# Altium project MotorDriver_Version1.0.PrjPcb
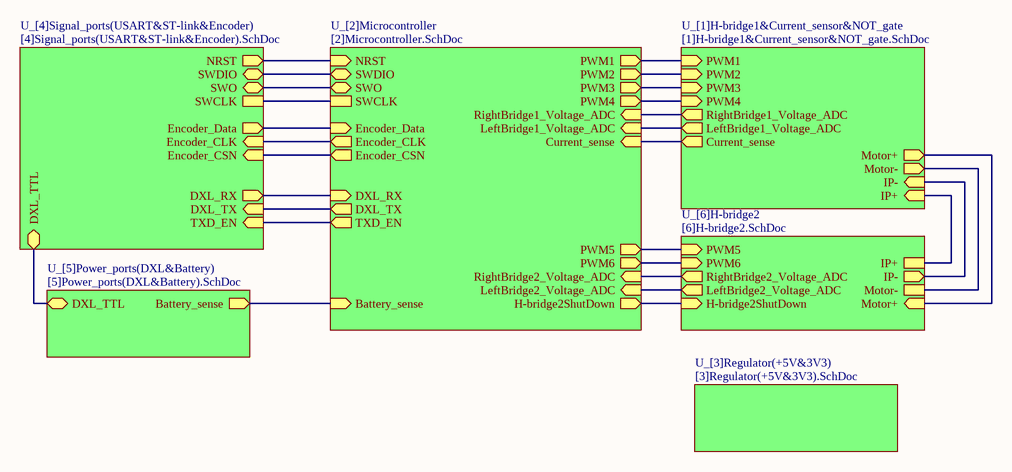
[diagram p0: [0]MotorDriver.SchDoc]
7 sheets, 112 parts. Net scope: hierarchical (ports join the sheet entries above them; power ports are global).
Board file: MotorDriver_Version1.0.PcbDoc
Sheets:
  [0]MotorDriver.SchDoc
    U_[1]H-bridge1&Current_sensor&NOT_gate = [1]H-bridge1&Current_sensor&NOT_gate.SchDoc
    U_[2]Microcontroller = [2]Microcontroller.SchDoc
    U_[3]Regulator(+5V&3V3) = [3]Regulator(+5V&3V3).SchDoc
    U_[5]Power_ports(DXL&Battery) = [5]Power_ports(DXL&Battery).SchDoc
    U_[6]H-bridge2 = [6]H-bridge2.SchDoc
    U_[4]Signal_ports(USART&ST-link&Encoder) = [4]Signal_ports(USART&ST-link&Encoder).SchDoc

## Sheet [0]MotorDriver.SchDoc
size A

### Sub-sheets
U_[1]H-bridge1&Current_sensor&NOT_gate = [1]H-bridge1&Current_sensor&NOT_gate.SchDoc: PWM1 (in), PWM2 (in), PWM3 (in), PWM4 (in), Current_sense (out), RightBridge1_Voltage_ADC (out), LeftBridge1_Voltage_ADC (out), Motor+ (out), Motor- (out), IP+ (in), IP- (in)
U_[2]Microcontroller = [2]Microcontroller.SchDoc: SWDIO (bidir), SWCLK, PWM1 (out), PWM2 (out), PWM3 (out), PWM4 (out), NRST (in), SWO (bidir), DXL_TX (out), DXL_RX (in), Current_sense (in), LeftBridge1_Voltage_ADC (in), RightBridge1_Voltage_ADC (in), Battery_sense (in), Encoder_CLK (out), Encoder_Data (in), Encoder_CSN (out), H-bridge2ShutDown (out), RightBridge2_Voltage_ADC (in), LeftBridge2_Voltage_ADC (in), PWM5 (out), PWM6 (out), TXD_EN (out)
U_[3]Regulator(+5V&3V3) = [3]Regulator(+5V&3V3).SchDoc: no entries
U_[4]Signal_ports(USART&ST-link&Encoder) = [4]Signal_ports(USART&ST-link&Encoder).SchDoc: SWDIO (bidir), SWCLK, SWO (bidir), NRST (out), Encoder_CLK (in), Encoder_CSN (in), Encoder_Data (out), TXD_EN (in), DXL_TX (in), DXL_RX (out), DXL_TTL (bidir)
U_[5]Power_ports(DXL&Battery) = [5]Power_ports(DXL&Battery).SchDoc: Battery_sense (out), DXL_TTL (bidir)
U_[6]H-bridge2 = [6]H-bridge2.SchDoc: H-bridge2ShutDown (in), PWM6 (in), PWM5 (in), IP+, IP- (out), LeftBridge2_Voltage_ADC (out), RightBridge2_Voltage_ADC (out), Motor-, Motor+ (in)

### Nets
H-bridge2ShutDown: sheet U_[2]Microcontroller/H-bridge2ShutDown, sheet U_[6]H-bridge2/H-bridge2ShutDown
IP+: sheet U_[1]H-bridge1&Current_sensor&NOT_gate/IP+, sheet U_[6]H-bridge2/IP+
IP-: sheet U_[1]H-bridge1&Current_sensor&NOT_gate/Motor+, sheet U_[1]H-bridge1&Current_sensor&NOT_gate/IP-, sheet U_[6]H-bridge2/IP-, sheet U_[6]H-bridge2/Motor+
NRST: sheet U_[2]Microcontroller/NRST, sheet U_[4]Signal_ports(USART&ST-link&Encoder)/NRST
PWM1: sheet U_[1]H-bridge1&Current_sensor&NOT_gate/PWM1, sheet U_[2]Microcontroller/PWM1
PWM2: sheet U_[1]H-bridge1&Current_sensor&NOT_gate/PWM2, sheet U_[2]Microcontroller/PWM2
SWO: sheet U_[2]Microcontroller/SWO, sheet U_[4]Signal_ports(USART&ST-link&Encoder)/SWO
NetB3_2: sheet U_[2]Microcontroller/PWM6, sheet U_[6]H-bridge2/PWM6
NetB3_6: sheet U_[1]H-bridge1&Current_sensor&NOT_gate/Motor-, sheet U_[6]H-bridge2/Motor-
NetB5_2: sheet U_[2]Microcontroller/PWM5, sheet U_[6]H-bridge2/PWM5
NetDXL_Encoder_A2: sheet U_[2]Microcontroller/Encoder_CSN, sheet U_[4]Signal_ports(USART&ST-link&Encoder)/Encoder_CSN
NetDXL_Encoder_A4: sheet U_[2]Microcontroller/Encoder_Data, sheet U_[4]Signal_ports(USART&ST-link&Encoder)/Encoder_Data
NetDXL_Encoder_A6: sheet U_[2]Microcontroller/Encoder_CLK, sheet U_[4]Signal_ports(USART&ST-link&Encoder)/Encoder_CLK
NetMotor_DXL_3: sheet U_[5]Power_ports(DXL&Battery)/DXL_TTL, sheet U_[4]Signal_ports(USART&ST-link&Encoder)/DXL_TTL
NetR6_1: sheet U_[1]H-bridge1&Current_sensor&NOT_gate/PWM3, sheet U_[2]Microcontroller/PWM3
NetR8_2: sheet U_[1]H-bridge1&Current_sensor&NOT_gate/PWM4, sheet U_[2]Microcontroller/PWM4
NetR13_1: sheet U_[2]Microcontroller/Battery_sense, sheet U_[5]Power_ports(DXL&Battery)/Battery_sense
NetR15_1: sheet U_[1]H-bridge1&Current_sensor&NOT_gate/LeftBridge1_Voltage_ADC, sheet U_[2]Microcontroller/LeftBridge1_Voltage_ADC
NetR17_1: sheet U_[1]H-bridge1&Current_sensor&NOT_gate/RightBridge1_Voltage_ADC, sheet U_[2]Microcontroller/RightBridge1_Voltage_ADC
NetR33_1: sheet U_[2]Microcontroller/LeftBridge2_Voltage_ADC, sheet U_[6]H-bridge2/LeftBridge2_Voltage_ADC
NetR35_1: sheet U_[2]Microcontroller/RightBridge2_Voltage_ADC, sheet U_[6]H-bridge2/RightBridge2_Voltage_ADC
NetR39_1: sheet U_[2]Microcontroller/DXL_RX, sheet U_[4]Signal_ports(USART&ST-link&Encoder)/DXL_RX
NetR44_2: sheet U_[1]H-bridge1&Current_sensor&NOT_gate/Current_sense, sheet U_[2]Microcontroller/Current_sense
NetST-link_2: sheet U_[2]Microcontroller/SWDIO, sheet U_[4]Signal_ports(USART&ST-link&Encoder)/SWDIO
NetST-link_3: sheet U_[2]Microcontroller/SWCLK, sheet U_[4]Signal_ports(USART&ST-link&Encoder)/SWCLK
NetU1_20: sheet U_[2]Microcontroller/TXD_EN, sheet U_[4]Signal_ports(USART&ST-link&Encoder)/TXD_EN
NetU1_21: sheet U_[2]Microcontroller/DXL_TX, sheet U_[4]Signal_ports(USART&ST-link&Encoder)/DXL_TX

## Sheet [1]H-bridge1&Current_sensor&NOT_gate.SchDoc
size A3
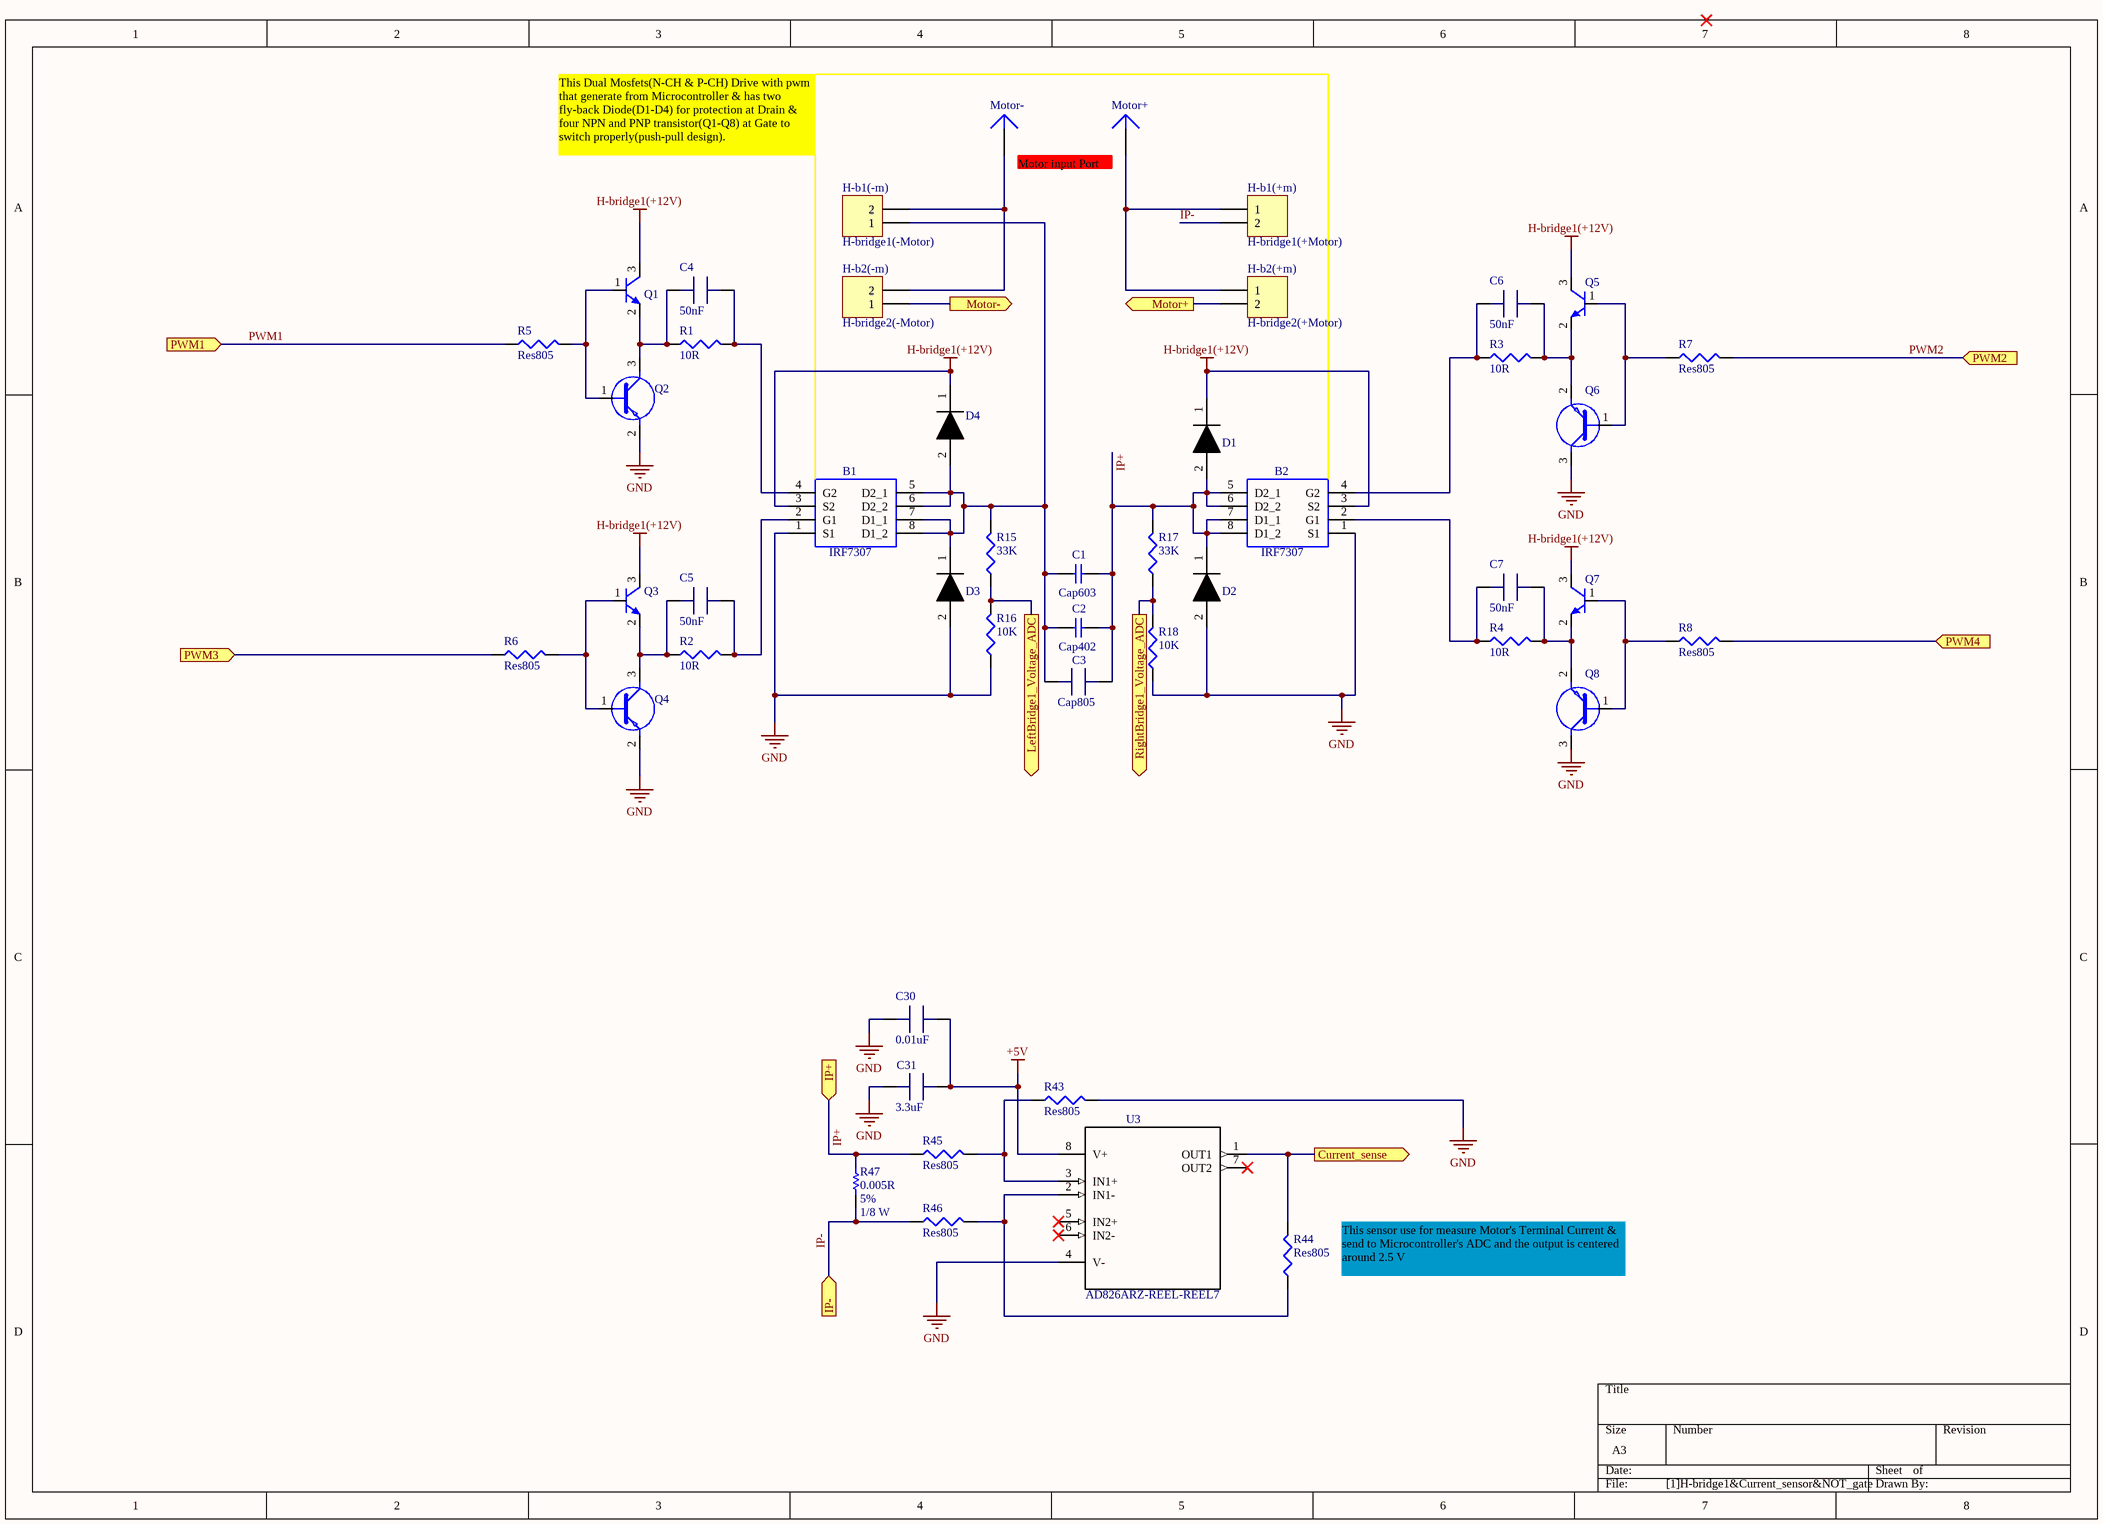
[diagram p1: [1]H-bridge1&Current_sensor&NOT_gate.SchDoc]

### Parts
B1  IRF7307  [SOIC127P600X175-8N]
B2  IRF7307  [SOIC127P600X175-8N]
C1  Cap603  [Cap603]
C2  Cap402  [Cap402]
C3  Cap805  [cap_805]
C4  50nF  [cap_805]
C5  50nF  [cap_805]
C6  50nF  [cap_805]
C7  50nF  [cap_805]
C30  0.01uF  [cap_805]
C31  3.3uF  [cap_805]
D1  Doide_SS34  [Doide_SS34]  (value not drawn)
D2  Doide_SS34  [Doide_SS34]  (value not drawn)
D3  Doide_SS34  [Doide_SS34]  (value not drawn)
D4  Doide_SS34  [Doide_SS34]  (value not drawn)
H-b1(+m)  H-bridge1(+Motor)  [HDR1X2]
H-b1(-m)  H-bridge1(-Motor)  [HDR1X2]
H-b2(+m)  H-bridge2(+Motor)  [HDR1X2]
H-b2(-m)  H-bridge2(-Motor)  [HDR1X2]
Motor+  Plug  [PIN1]  (value not drawn)
Motor-  Plug  [PIN1]  (value not drawn)
Q1  NPN(mmbt2222)  [MMBT2222]  (value not drawn)
Q2  MMBT2907A-7-F  [SOT96P240X100-3N]  (value not drawn)
Q3  NPN(mmbt2222)  [MMBT2222]  (value not drawn)
Q4  MMBT2907A-7-F  [SOT96P240X100-3N]  (value not drawn)
Q5  NPN(MMBT2222)  [MMBT2222]  (value not drawn)
Q6  MMBT2907A-7-F  [SOT96P240X100-3N]  (value not drawn)
Q7  NPN(mmbt2222)  [MMBT2222]  (value not drawn)
Q8  MMBT2907A-7-F  [SOT96P240X100-3N]  (value not drawn)
R1  10R  [Res805]
R2  10R  [Res805]
R3  10R  [Res805]
R4  10R  [Res805]
R5  Res805  [Res805]
R6  Res805  [Res805]
R7  Res805  [Res805]
R8  Res805  [Res805]
R15  33K  [Res805]
R16  10K  [Res805]
R17  33K  [Res805]
R18  10K  [Res805]
R43  Res805  [Res805]
R44  Res805  [Res805]
R45  Res805  [Res805]
R46  Res805  [Res805]
R47  Tolerance: 5%  Power: 1/8 W  [RES 2512 (6331X07L)]  (hidden comment: 0.005R)
U3  AD826ARZ-REEL-REEL7  [*SOIC127P600X175-8N]

### Ports
Current_sense (out), IP+ (in), IP- (in), LeftBridge1_Voltage_ADC (out), Motor+ (out), Motor- (out), PWM1 (in), PWM2 (in), PWM3 (in), PWM4 (in), RightBridge1_Voltage_ADC (out)

### Nets
+5V: C30.2 C31.2 U3.8(V+)
GND: B1.1(S1) B2.1(S1) C30.1 C31.1 D2.2 D3.2 Q2.2(E) Q4.2(E) Q6.3(C) Q8.3(C) R16.1 R18.1 R43.2 U3.4(V-)
H-bridge1(+12V): B1.3(S2) B2.3(S2) D1.1 D4.1 Q1.3(C) Q3.3(C) Q5.3(C) Q7.3(C)
IP+: B2.5(D2_1) B2.6(D2_2) B2.7(D1_1) B2.8(D1_2) C1.2 C2.2 C3.2 D1.2 D2.1 R17.2 R45.1 R47.2 ; port IP+
IP-: H-b1(+m).2 H-b2(+m).2 R46.1 R47.1 ; port Motor+, port IP-
PWM1: R5.1 ; port PWM1
PWM2: R7.2 ; port PWM2
NetB1_2: B1.2(G1) C5.2 R2.2
NetB1_4: B1.4(G2) C4.2 R1.2
NetB1_5: B1.5(D2_1) B1.6(D2_2) B1.7(D1_1) B1.8(D1_2) C1.1 C2.1 C3.1 D3.1 D4.2 H-b1(-m).1 R15.2
NetB2_2: B2.2(G1) C7.1 R4.1
NetB2_4: B2.4(G2) C6.1 R3.1
NetB3_6: H-b2(-m).1 ; port Motor-
NetC4_1: C4.1 Q1.2(E) Q2.3(C) R1.1
NetC5_1: C5.1 Q3.2(E) Q4.3(C) R2.1
NetC6_2: C6.2 Q5.2(E) Q6.2(E) R3.2
NetC7_2: C7.2 Q7.2(E) Q8.2(E) R4.2
NetH-b1(+m)_1: H-b1(+m).1 H-b2(+m).1 Motor+.1
NetH-b1(-m)_2: H-b1(-m).2 H-b2(-m).2 Motor-.1
NetQ1_1: Q1.1(B) Q2.1(B) R5.2
NetQ3_1: Q3.1(B) Q4.1(B) R6.2
NetQ5_1: Q5.1(B) Q6.1(B) R7.1
NetQ7_1: Q7.1(B) Q8.1(B) R8.1
NetR6_1: R6.1 ; port PWM3
NetR8_2: R8.2 ; port PWM4
NetR15_1: R15.1 R16.2 ; port LeftBridge1_Voltage_ADC
NetR17_1: R17.1 R18.2 ; port RightBridge1_Voltage_ADC
NetR43_1: R43.1 R45.2 U3.3(IN1+)
NetR44_1: R44.1 R46.2 U3.2(IN1-)
NetR44_2: R44.2 U3.1(OUT1) ; port Current_sense

Not connected (* = marked no-connect by the designer): U3 5(IN2+)* 6(IN2-)* 7(OUT2)*

### Notes on the sheet
- This Dual Mosfets(N-CH & P-CH) Drive with pwm that generate from Microcontroller & has two fly-back Diode(D1-D4) for protection at Drain & four NPN and PNP transistor(Q1-Q8) at Gate to switch properly(push-pull design).
- Motor input Port
- This sensor use for measure Motor's Terminal Current & send to Microcontroller's ADC and the output is centered around 2.5 V

### Library data of the parts
B1 B2 = IRF7307: Power MOSFET; Manufacturer_Name: International Rectifier; Geometry.Height: 1.75mm; Manufacturer_Part_Number: IRF7307; RS Part Number: 2171031; RS Price/Stock: http://uk.rs-online.com/web/p/products/2171031; Arrow Part Number: IRF7307; Arrow Price/Stock: http://uk.rs-online.com/web/p/products/2171031; Datasheet Link: www.farnell.com/datasheets/137583.pdf
C4-C7 C30 C31 = cap805
H-b1(+m) H-b1(-m) H-b2(+m) H-b2(-m) = Header 2: Header, 2-Pin; LatestRevisionDate: 17-Jul-2002; LatestRevisionNote: Re-released for DXP Platform.; Publisher: Altium Limited
Q1 Q3 Q5 Q7 = MMBT2222
Q2 Q4 Q6 Q8 = MMBT2907A-7-F: Diodes Inc MMBT2907A-7-F PNP Bipolar Transistor, -600 mA, -60 V, 3-Pin SOT-23; Manufacturer_Name: Diodes Inc.; Geometry.Height: 1mm; Manufacturer_Part_Number: MMBT2907A-7-F; RS Part Number: 7114875P; RS Price/Stock: http://uk.rs-online.com/web/p/products/7114875P; Arrow Part Number: MMBT2907A-7-F; Arrow Price/Stock: https://www.arrow.com/en/products/mmbt2907a-7-f/diodes-incorporated; Datasheet Link: https://www.diodes.com/assets/Datasheets/ds30040.pdf
R1-R4 R15-R18 = Res805
R47 = RES: Resistor; Designer: Saeid Jorablo; Category: Resistors; PackageDescription: SMD & TH Resistors; Publisher: Altium Limited; Mounting Technology: Surface Mount\Through-Hole; Value: 0.005R; HelpURL: http://s3.picofile.com/file/7443264187/Coming_Soon_logo.gif
U3 = AD826ARZ-REEL-REEL7: OP Amp Dual Volt Fdbk Ã‚Â±18V/36V 8-Pin SO T/R; MP: AD826ARZ-REEL7; MF: Analog Devices; Package: SOIC-8 Analog Devices; Price: None; SnapEDA_Link: https://www.snapeda.com/parts/AD826ARZ-REEL7/Analog%20Devices%20Inc./view-part/?ref=snap; Availability: Unavailable; Value: *
Motor+ Motor- = Plug: LatestRevisionDate: 17-Jul-2002; LatestRevisionNote: Re-released for DXP Platform.; Publisher: Altium Limited

## Sheet [2]Microcontroller.SchDoc
size A
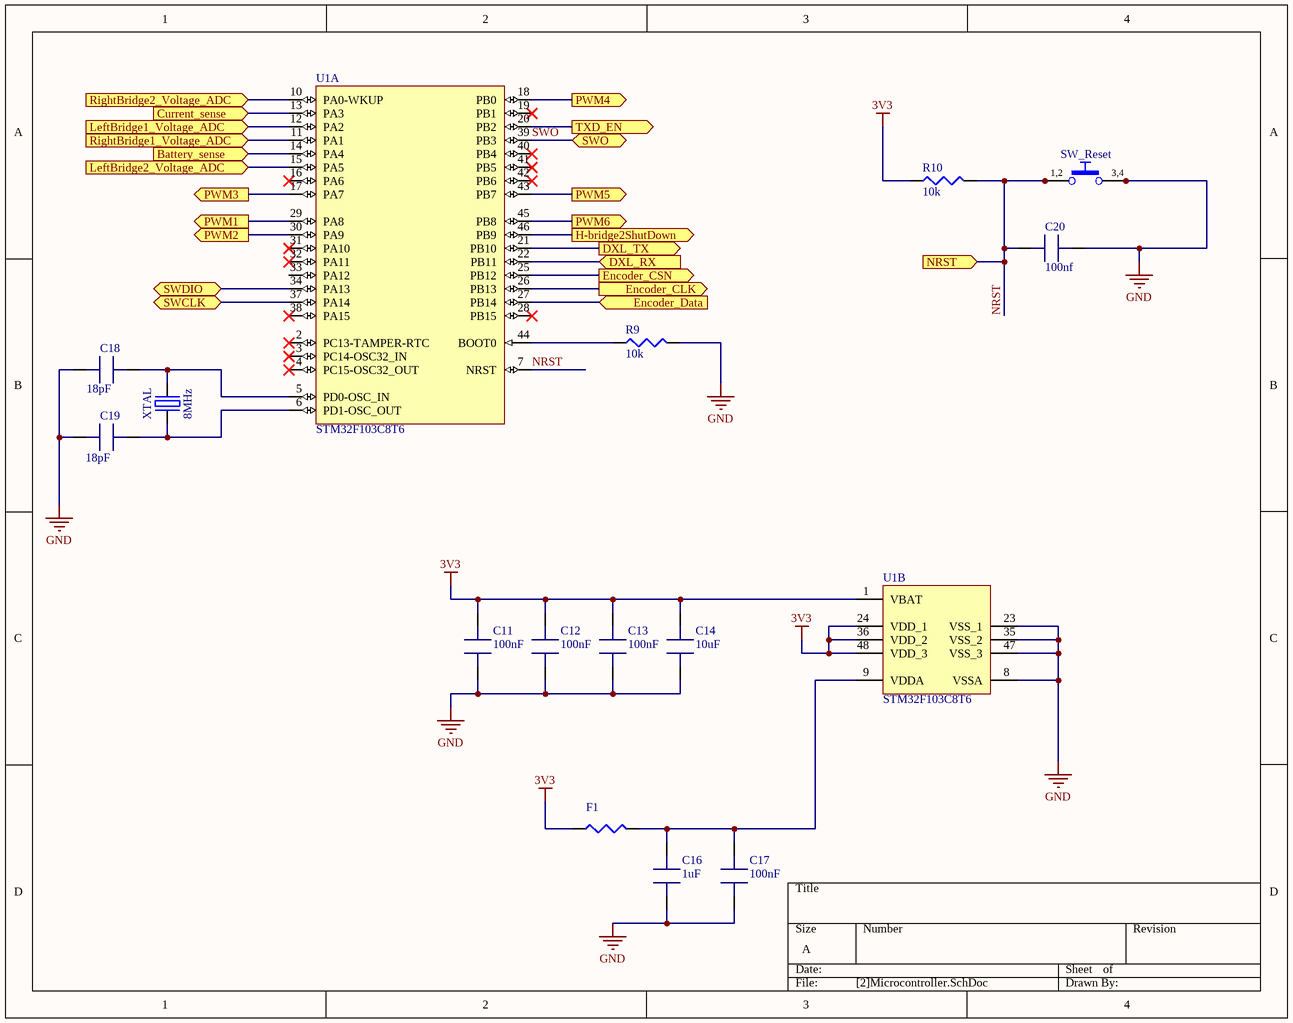
[diagram p2: [2]Microcontroller.SchDoc]

### Parts
C11  100nF  [cap_805]
C12  100nF  [cap_805]
C13  100nF  [cap_805]
C14  10uF  [cap_805]
C16  1uF  [cap_805]
C17  100nF  [cap_805]
C18  18pF  [cap_805]
C19  18pF  [cap_805]
C20  100nf  [cap_805]
F1  Res805  [Res805]  (value not drawn)
R9  10k  [Res805]
R10  10k  [Res805]
SW_Reset  Push Button  [PB_OMRON_B3F-1000]  (value not drawn)
U1  STM32F103C8T6  [STM-LQFP48_N]  (parts A,B of 2)
XTAL  8MHz  [XTAL_HC-49/U]

### Ports
Battery_sense (in), Current_sense (in), DXL_RX (in), DXL_TX (out), Encoder_CLK (out), Encoder_CSN (out), Encoder_Data (in), H-bridge2ShutDown (out), LeftBridge1_Voltage_ADC (in), LeftBridge2_Voltage_ADC (in), NRST (in), PWM1 (out), PWM2 (out), PWM3 (out), PWM4 (out), PWM5 (out), PWM6 (out), RightBridge1_Voltage_ADC (in), RightBridge2_Voltage_ADC (in), SWCLK, SWDIO (bidir), SWO (bidir), TXD_EN (out)

### Nets
3V3: C11.2 C12.2 C13.2 C14.2 F1.1 R10.1 U1.1(VBAT) U1.24(VDD_1) U1.36(VDD_2) U1.48(VDD_3)
GND: C11.1 C12.1 C13.1 C14.1 C16.1 C17.1 C18.1 C19.1 C20.2 R9.2 SW_Reset.3 SW_Reset.4 U1.8(VSSA) U1.23(VSS_1) U1.35(VSS_2) U1.47(VSS_3)
H-bridge2ShutDown: U1.46(PB9) ; port H-bridge2ShutDown
NRST: C20.1 R10.2 SW_Reset.1 SW_Reset.2 U1.7(NRST) ; port NRST
PWM1: U1.29(PA8) ; port PWM1
PWM2: U1.30(PA9) ; port PWM2
SWO: U1.39(PB3) ; port SWO
NetB3_2: U1.45(PB8) ; port PWM6
NetB5_2: U1.43(PB7) ; port PWM5
NetC16_2: C16.2 C17.2 F1.2 U1.9(VDDA)
NetC18_2: C18.2 U1.5(PD0-OSC_IN) XTAL.2(OSC2)
NetC19_2: C19.2 U1.6(PD1-OSC_OUT) XTAL.1(OSC1)
NetDXL_Encoder_A2: U1.25(PB12) ; port Encoder_CSN
NetDXL_Encoder_A4: U1.27(PB14) ; port Encoder_Data
NetDXL_Encoder_A6: U1.26(PB13) ; port Encoder_CLK
NetR6_1: U1.17(PA7) ; port PWM3
NetR8_2: U1.18(PB0) ; port PWM4
NetR9_1: R9.1 U1.44(BOOT0)
NetR13_1: U1.14(PA4) ; port Battery_sense
NetR15_1: U1.12(PA2) ; port LeftBridge1_Voltage_ADC
NetR17_1: U1.11(PA1) ; port RightBridge1_Voltage_ADC
NetR33_1: U1.15(PA5) ; port LeftBridge2_Voltage_ADC
NetR35_1: U1.10(PA0-WKUP) ; port RightBridge2_Voltage_ADC
NetR39_1: U1.22(PB11) ; port DXL_RX
NetR44_2: U1.13(PA3) ; port Current_sense
NetST-link_2: U1.34(PA13) ; port SWDIO
NetST-link_3: U1.37(PA14) ; port SWCLK
NetU1_20: U1.20(PB2) ; port TXD_EN
NetU1_21: U1.21(PB10) ; port DXL_TX

Not connected (* = marked no-connect by the designer): U1 2(PC13-TAMPER-RTC)* 3(PC14-OSC32_IN)* 4(PC15-OSC32_OUT)* 16(PA6)* 19(PB1)* 28(PB15)* 31(PA10)* 32(PA11)* 33(PA12) 38(PA15)* 40(PB4)* 41(PB5)* 42(PB6)*

### Notes on the sheet
- (in symbol PB_OMRON_B3F-1000) 1,2; 3,4

### Library data of the parts
C11-C14 C16-C20 = cap805
R9 R10 = Res805
SW_Reset = PB_OMRON_B3F-1000: Push-Button Switch SPDT; Part Description: 24VDC 50mA SPST-NO Tactile Push-Button Switch (h=4.5mm); Manufacturer: OMRON; Table: Switches; Part Number: PB_OMRON_B3F-1000; Component Kind: Standard; Component Type: Standard; Pin Count: 4; PackageDescription: 6x6mm Model, Horizontal, Flat Plunger Type (without Ground Terminal) Pushbutton Switch, OMRON B3F Series; Family: Push Button; Mounted: Yes; Socket: No; SMD: No; Status: None; Manufacturer Part Number: B3F-1000; ComponentHeight: 4.5mm; HelpURL: \\cern.ch\dfs\Applications\Altium\Datasheets\PB_OMRON_B3F-1000.pdf; Author: CERN DEM JMW; CreateDate: 10/23/2008; LatestRevisionDate: 5/6/2009
U1 = STM32F103C8T6: ARM Cortex-M3 32-bit MCU, 64 KB Flash, 20 KB Internal RAM, 37 I/Os, 48-pin LQFP, -40 to 85 degC, Tray; A/D Converter: 2x12-bit (10 Channel); FLASH Size (Prog) (kB): 64; I/Os (High Current): 37; Internal RAM Size (kB): 20; Operating Frequency(F) (Processor speed) (MHz): 72; Supply Voltage(Vcc) min (V): 2; DatasheetVersion: Rev. 16; PackageVersion: Rev. 6, 06/2013; PackageReference: LQFP48; PackageDescription: 48-Pin Low Profile Quad Flat Package, 7 x 7 mm Body, 0.5 mm Pitch; Supplier 1: Digi-Key; Supplier Part Number 1: 497-6063-ND; Supplier 2: Farnell; Supplier Part Number 2: 1447637; Supplier 3: Newark; Supplier Part Number 3: 59M2182; Supplier 4: Newark; Supplier Part Number 4: 57P1222; Supplier 5: Mouser; Supplier Part Number 5: 511-STM32F103C8T6; Core: ARM Cortex-M3; Packing: Tray; Mounting Technology: Surface Mount; PartNumber: STM32F103C8T6; ComponentLink1Description: Manufacturer URL; ComponentLink1URL: http://www.st.com/web/en/home.html; ComponentLink2Description: Datasheet; ComponentLink2URL: http://www.st.com/st-web-ui/static/active/en/resource/technical/document/datasheet/CD00161566.pdf; ComponentLink3Description: Package Specification; ComponentLink3URL: http://www.st.com/st-web-ui/static/active/en/resource/technical/document/datasheet/DM00058181.pdf
XTAL = XTAL_20MHZ_AEL_HC-49/U: Quartz Crystal; Part Description: ±30ppm Quartz Crystal Resonator, HC-49/U Type; Manufacturer: AEL CRYSTALS; Manufacturer Part Number: X20M000000L010; Value: 20MHz; Table: Crystals & Oscillators; Part Number: XTAL_20MHZ_AEL_HC-49/U; Component Kind: Standard; Component Type: Standard; PackageDescription: HC-49/U Leaded Cristal, Body 11.05x4.8mm; Pitch 4.88mm; Pin Count: 2; Mounted: Yes; Socket: No; SMD: No; ComponentHeight: 13.6mm; HelpURL: \\cern.ch\dfs\Applications\Altium\Datasheets\XTAL_AEL_HC-49-U.pdf; Author: CERN DEM JMW; CreateDate: 10/31/2008; LatestRevisionDate: 5/13/2011

## Sheet [3]Regulator(+5V&3V3).SchDoc
size A; PageSetup: Record=PageOptions|CenterHorizontal=True|CenterVertical=True|PrintScale=1.00|XCorrection=1.00|YCorrection=1.00|PrintKind=1|BorderSize=5000000|LeftOffset=0|BottomOffset=0|Orientation=1|PaperLength=1000|PaperWidth=1000|Scale=100|PaperSource=7|PrintQuality=-3|MediaType=1|DitherType=10|PrintScaleMode=1|PaperKind=Letter|PaperIndex=1
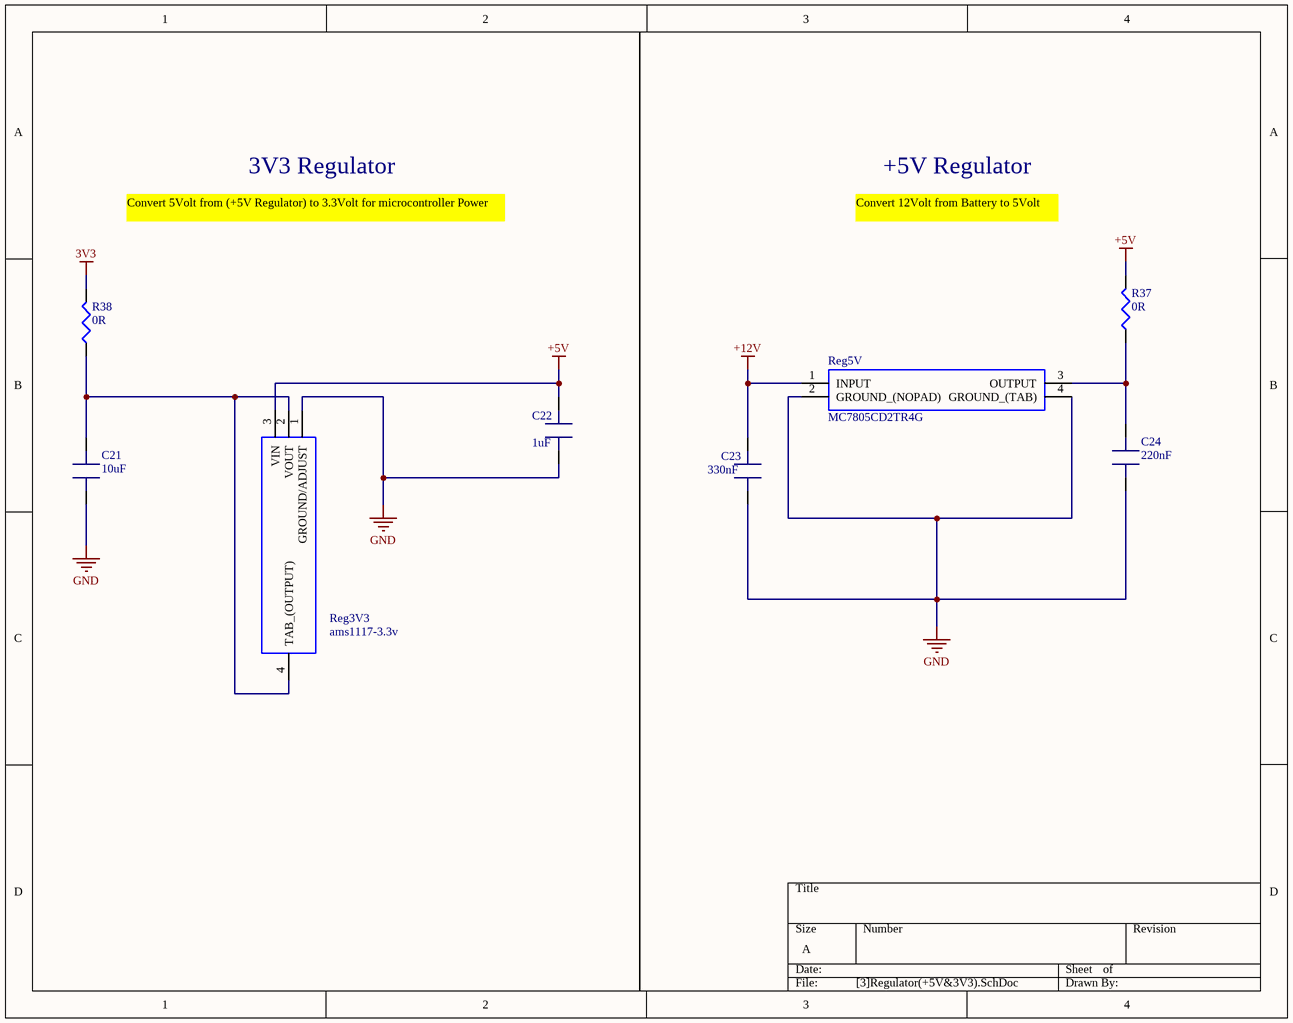
[diagram p3: [3]Regulator(+5V&3V3).SchDoc]

### Parts
C21  10uF  [cap_805]
C22  1uF  [cap_805]
C23  330nF  [cap_805]
C24  220nF  [cap_805]
R37  0R  [Res805]
R38  0R  [Res805]
Reg3V3  ams1117-3.3v  [SOT229P700X180-4N]
Reg5V  MC7805CD2TR4G  [TO254P1420X457-4N]

### Nets
3V3: R38.2
+5V: C22.2 R37.2 Reg3V3.3(VIN)
+12V: C23.2 Reg5V.1(INPUT)
GND: C21.1 C22.1 C23.1 C24.1 Reg3V3.1(GROUND/ADJUST) Reg5V.2(GROUND_(NOPAD)) Reg5V.4(GROUND_(TAB))
NetC21_2: C21.2 R38.1 Reg3V3.2(VOUT) Reg3V3.4(TAB_(OUTPUT))
NetC24_2: C24.2 R37.1 Reg5V.3(OUTPUT)

### Notes on the sheet
- Convert 5Volt from (+5V Regulator) to 3.3Volt for microcontroller Power
- 3V3 Regulator
- Convert 12Volt from Battery to 5Volt
- +5V Regulator

### Library data of the parts
C21-C24 = cap805
R37 R38 = Res805
Reg3V3 = ams1117-3.3v: 1A LOW DROPOUT VOLTAGE REGULATOR, SOT-223; Manufacturer_Name: Advanced Monolithic Systems; Geometry.Height: 1.8mm; Manufacturer_Part_Number: ams1117-3.3v; RS Part Number: *; RS Price/Stock: *; Arrow Part Number: ams1117-3.3v; Arrow Price/Stock: *; Datasheet Link: http://www.advanced-monolithic.com/pdf/ds1117.pdf
Reg5V = MC7805CD2TR4G: Manufacturer_Name: ON Semiconductor; Allied_Number: 70099956; Geometry.Height: 4.572mm; Manufacturer_Part_Number: MC7805CD2TR4G; RS Part Number: 1454706; RS Price/Stock: http://uk.rs-online.com/web/p/products/1454706; Allied Price/Stock: http://www.alliedelec.com/on-semiconductor-mc7805cd2tr4g/70099956/; Arrow Part Number: MC7805CD2TR4G; Arrow Price/Stock: https://www.arrow.com/en/products/mc7805cd2tr4g/on-semiconductor; Datasheet Link: http://www.onsemi.com/pub/Collateral/MC7800-D.PDF

## Sheet [5]Power_ports(DXL&Battery).SchDoc
size A
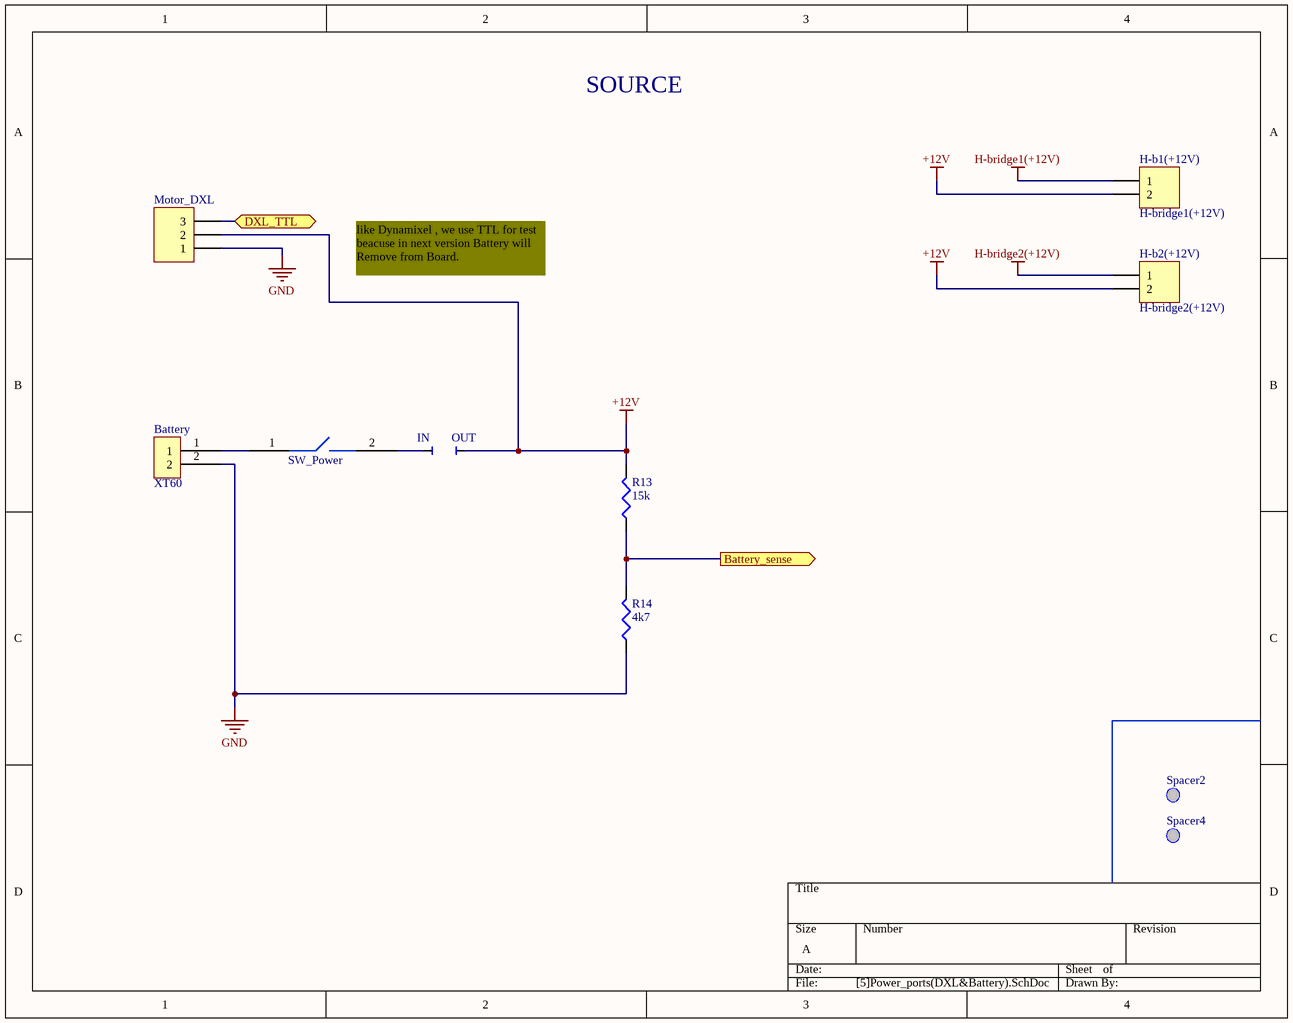
[diagram p4: [5]Power_ports(DXL&Battery).SchDoc]

### Parts
Battery  XT60  [XT60]
H-b1(+12V)  H-bridge1(+12V)  [HDR1X2]
H-b2(+12V)  H-bridge2(+12V)  [HDR1X2]
IN  Fuse Clip  [FUSH_LITTELFUSE_520]  (value not drawn)
Motor_DXL  Molex 22-03-5035  [Molex 22-3-5035]  (value not drawn)
OUT  Fuse Clip  [FUSH_LITTELFUSE_520]  (value not drawn)
R13  15k  [Res805]
R14  4k7  [Res805]
Spacer2  Spacer 12mm  [Spacer 12mm]  (value not drawn)
Spacer4  Spacer 12mm  [Spacer 12mm]  (value not drawn)
SW_Power  SW_KCD11  [SW_KCD11]  (value not drawn)

### Ports
Battery_sense (out), DXL_TTL (bidir)

### Nets
+12V: H-b1(+12V).2 H-b2(+12V).2 Motor_DXL.2 OUT.1 R13.2
GND: Battery.2 Motor_DXL.1 R14.1
H-bridge1(+12V): H-b1(+12V).1
H-bridge2(+12V): H-b2(+12V).1
NetBattery_1: Battery.1 SW_Power.1
NetIN_1: IN.1 SW_Power.2
NetMotor_DXL_3: Motor_DXL.3 ; port DXL_TTL
NetR13_1: R13.1 R14.2 ; port Battery_sense

### Notes on the sheet
- SOURCE
- like Dynamixel , we use TTL for test beacuse in next version Battery will Remove from Board.

### Library data of the parts
H-b1(+12V) H-b2(+12V) = Header 2: Header, 2-Pin; LatestRevisionDate: 17-Jul-2002; LatestRevisionNote: Re-released for DXP Platform.; Publisher: Altium Limited
IN OUT = FUSH_LITTELFUSE_52000001009: Part Description: Fuse Clip for 5mm Diameter Fuses; Table: Fuses; Part Number: FUSH_LITTELFUSE_52000001009; Component Kind: Standard; Component Type: Standard; Pin Count: 1; PackageDescription: Fuse Clip for 5mm Diameter Fuses; Family: Fuse Holder; Mounted: Yes; Socket: No; SMD: No; Manufacturer: LITTELFUSE; Manufacturer Part Number: 52000001009; ComponentHeight: 10mm; HelpURL: \\cern.ch\dfs\Applications\Altium\Datasheets\FUSH_LITTELFUSE_520.pdf; Author: CERN DEM JLC; CreateDate: 6/19/2013; LatestRevisionDate: 6/19/2013
R13 R14 = Res805
SW_Power = SW_KCD11: KCD11

## Sheet [6]H-bridge2.SchDoc
size Tabloid
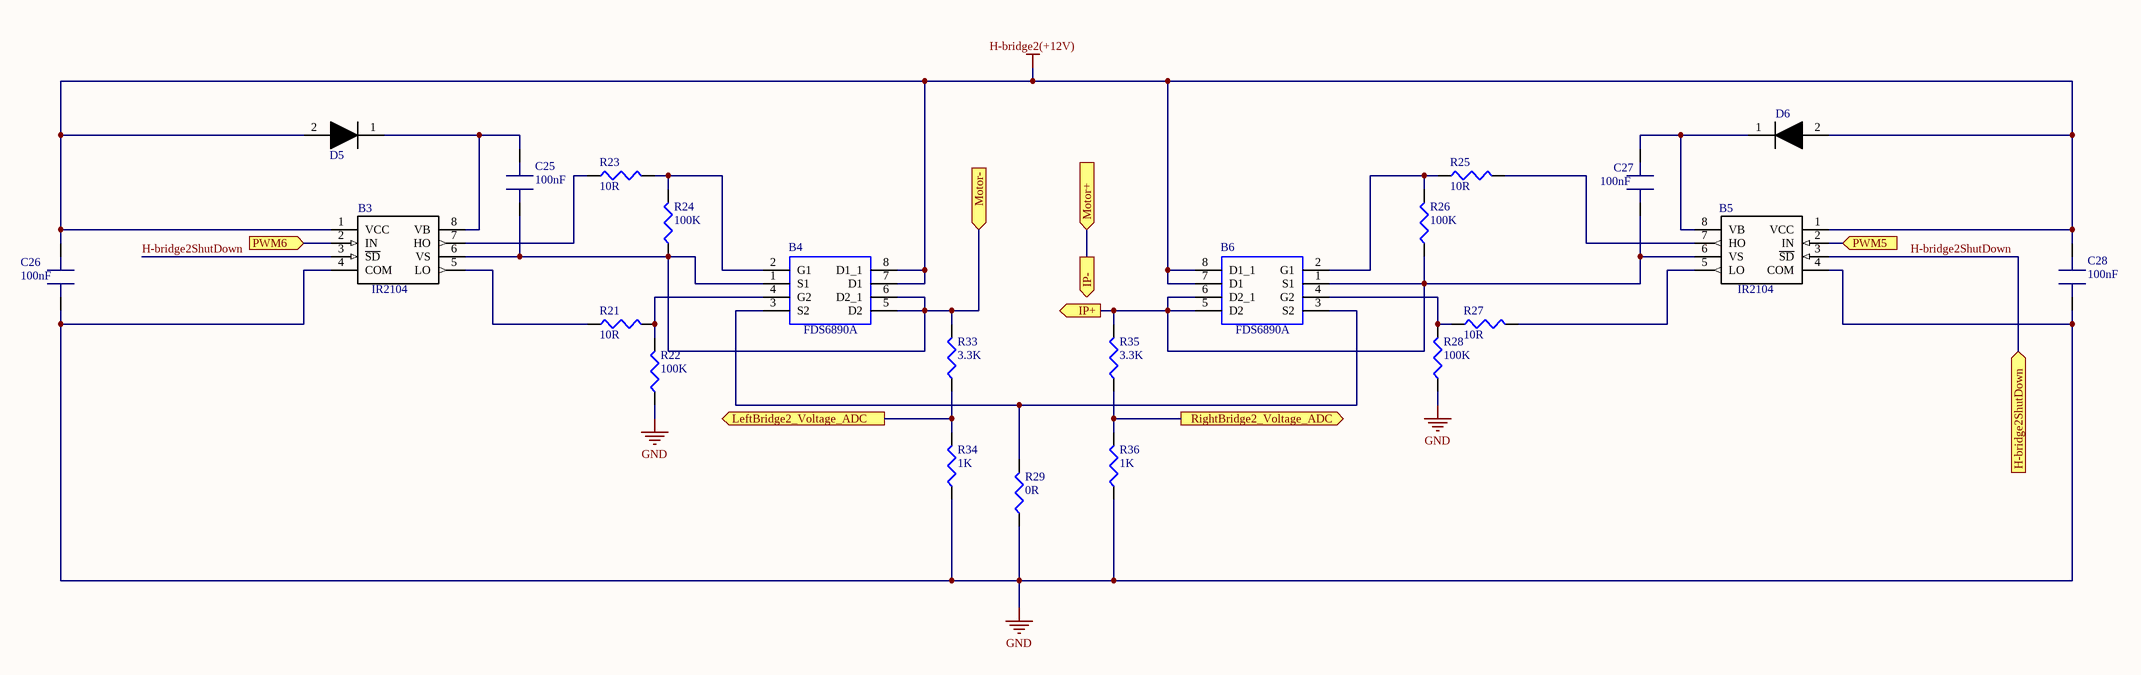
[diagram p5: [6]H-bridge2.SchDoc]

### Parts
B3  IR2104  [*SOIC127P600X175-8N]
B4  FDS6890A  [SOIC127P600X175-8N]
B5  IR2104  [*SOIC127P600X175-8N]
B6  FDS6890A  [SOIC127P600X175-8N]
C25  100nF  [cap_805]
C26  100nF  [cap_805]
C27  100nF  [cap_805]
C28  100nF  [cap_805]
D5  Doide_SS34  [Doide_SS34]  (value not drawn)
D6  Doide_SS34  [Doide_SS34]  (value not drawn)
R21  10R  [Res805]
R22  100K  [Res805]
R23  10R  [Res805]
R24  100K  [Res805]
R25  10R  [Res805]
R26  100K  [Res805]
R27  10R  [Res805]
R28  100K  [Res805]
R29  0R  [Res805]
R33  3.3K  [Res805]
R34  1K  [Res805]
R35  3.3K  [Res805]
R36  1K  [Res805]

### Ports
H-bridge2ShutDown (in), IP+, IP- (out), LeftBridge2_Voltage_ADC (out), Motor+ (in), Motor-, PWM5 (in), PWM6 (in), RightBridge2_Voltage_ADC (out)

### Nets
GND: B3.4(COM) B5.4(COM) C26.1 C28.1 R22.1 R28.1 R29.1 R34.1 R36.1
H-bridge2(+12V): B3.1(VCC) B4.7(D1) B4.8(D1_1) B5.1(VCC) B6.7(D1) B6.8(D1_1) C26.2 C28.2 D5.2 D6.2
H-bridge2ShutDown: B3.3(~{SD}) B5.3(~{SD}) ; port H-bridge2ShutDown
IP+: B5.6(VS) B6.1(S1) B6.5(D2) B6.6(D2_1) C27.1 R26.1 R35.2 ; port IP+
IP-: port IP-, port Motor+
NetB3_2: B3.2(IN) ; port PWM6
NetB3_5: B3.5(LO) R21.1
NetB3_6: B3.6(VS) B4.1(S1) B4.5(D2) B4.6(D2_1) C25.1 R24.1 R33.2 ; port Motor-
NetB3_7: B3.7(HO) R23.1
NetB3_8: B3.8(VB) C25.2 D5.1
NetB4_2: B4.2(G1) R23.2 R24.2
NetB4_3: B4.3(S2) B6.3(S2) R29.2
NetB4_4: B4.4(G2) R21.2 R22.2
NetB5_2: B5.2(IN) ; port PWM5
NetB5_5: B5.5(LO) R27.2
NetB5_7: B5.7(HO) R25.2
NetB5_8: B5.8(VB) C27.2 D6.1
NetB6_2: B6.2(G1) R25.1 R26.2
NetB6_4: B6.4(G2) R27.1 R28.2
NetR33_1: R33.1 R34.2 ; port LeftBridge2_Voltage_ADC
NetR35_1: R35.1 R36.2 ; port RightBridge2_Voltage_ADC

### Library data of the parts
B3 B5 = IR2104STRPBF: Half Bridge Driver, Single Input Plus Inverting Shutdown Pin, Fixed 520ns Deadtime in a 8-Lead package; MF: Infineon Technologies; MP: IR2104STRPBF; SnapEDA_Link: https://www.snapeda.com/parts/IR2104STRPBF/Infineon%20Technologies/view-part/?ref=snap; Package: SOIC-8 Infineon; Digi-Key_Part_Number: IR2104SPBFCT-ND; Digi-Key_Purchase_URL: https://www.digikey.com/product-detail/en/infineon-technologies/IR2104STRPBF/IR2104SPBFCT-ND/812609?utm_source=snapeda&utm_medium=aggregator&utm_campaign=symbol; Value: *
B4 B6 = FDS6890A: FDS6890A, Dual N-channel MOSFET Transistor 7.5 A 20 V, 8-Pin SOIC; Manufacturer_Name: Fairchild Semiconductor; Geometry.Height: 1.75mm; Manufacturer_Part_Number: FDS6890A; RS Part Number: 6710633P; RS Price/Stock: http://uk.rs-online.com/web/p/products/6710633P; Mouser Part Number: 512-FDS6890A; Mouser Price/Stock: https://www.mouser.com/Search/Refine.aspx?Keyword=512-FDS6890A; Datasheet Link: http://docs-emea.rs-online.com/webdocs/0d23/0900766b80d235c9.pdf
C25-C28 = cap805
R21-R29 R33-R36 = Res805

## Sheet [4]Signal_ports(USART&ST-link&Encoder).SchDoc
size A; PageSetup: Record=PageOptions|CenterHorizontal=True|CenterVertical=True|PrintScale=1.00|XCorrection=1.00|YCorrection=1.00|PrintKind=1|BorderSize=5000000|LeftOffset=0|BottomOffset=0|Orientation=1|PaperLength=1000|PaperWidth=1000|Scale=100|PaperSource=7|PrintQuality=-3|MediaType=1|DitherType=10|PrintScaleMode=1|PaperKind=A4|PaperIndex=9
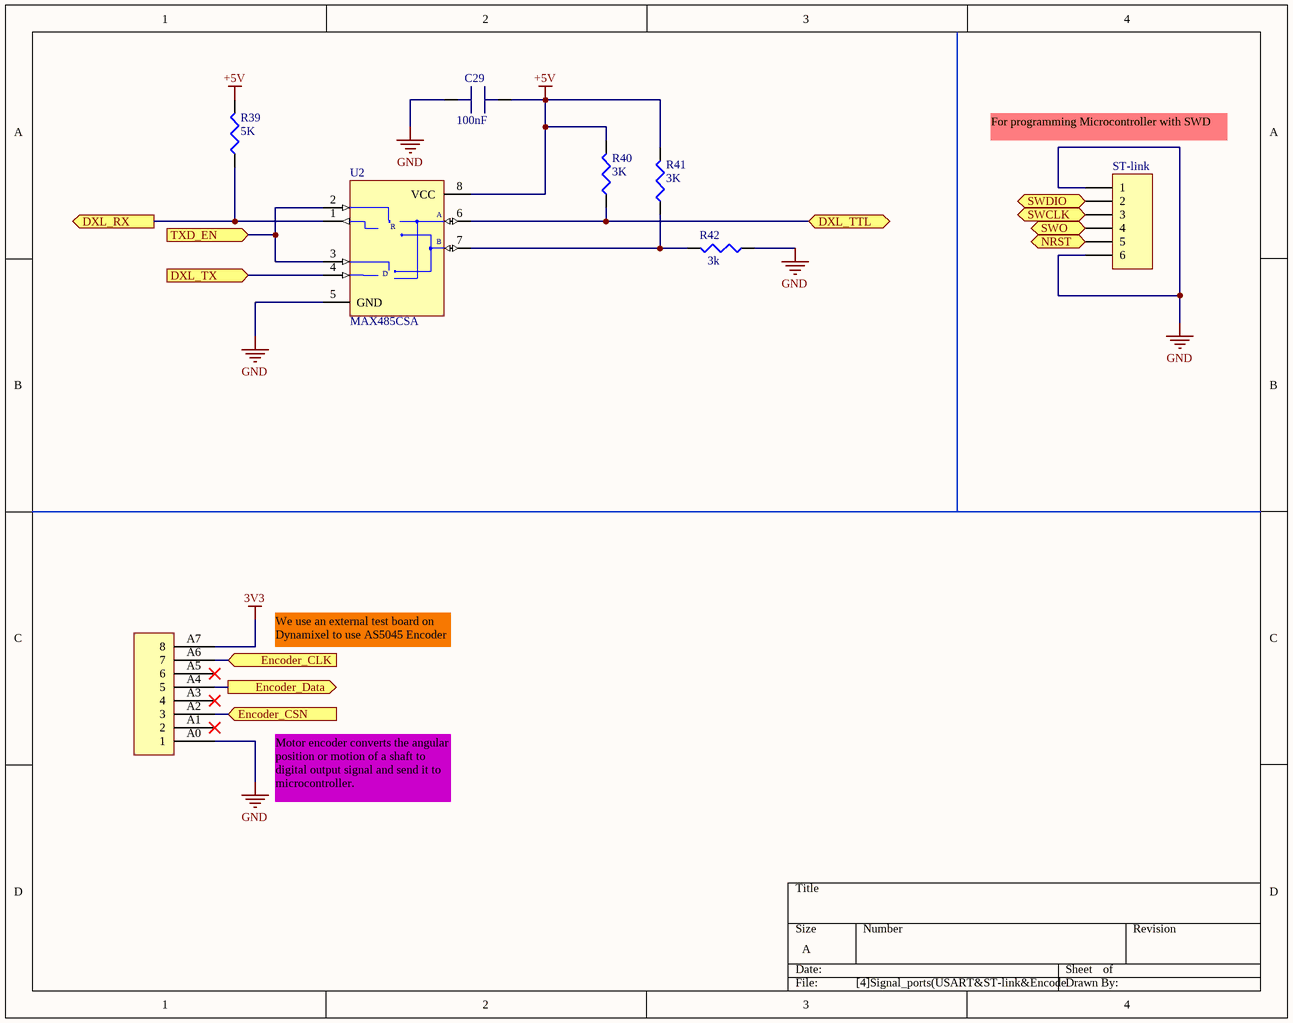
[diagram p6: [4]Signal_ports(USART&ST-link&Encoder).SchDoc]

### Parts
C29  100nF  [cap_805]
DXL_Encoder  pinheader 8  [PinHeader Female 8]  (value not drawn)
R39  5K  [Res805]
R40  3K  [Res805]
R41  3K  [Res805]
R42  3k  [Res805]
ST-link  Molex 22-03-5065  [Molex 22-03-5065]  (value not drawn)
U2  MAX485CSA  [NSO8_N]

### Ports
DXL_RX (out), DXL_TTL (bidir), DXL_TX (in), Encoder_CLK (in), Encoder_CSN (in), Encoder_Data (out), NRST (out), SWCLK, SWDIO (bidir), SWO (bidir), TXD_EN (in)

### Nets
3V3: DXL_Encoder.A7(8)
+5V: C29.2 R39.2 R40.2 R41.2 U2.8(VCC)
GND: C29.1 DXL_Encoder.A0(1) R42.1 ST-link.1 ST-link.6 U2.5(GND)
NRST: ST-link.5 ; port NRST
SWO: ST-link.4 ; port SWO
NetDXL_Encoder_A2: DXL_Encoder.A2(3) ; port Encoder_CSN
NetDXL_Encoder_A4: DXL_Encoder.A4(5) ; port Encoder_Data
NetDXL_Encoder_A6: DXL_Encoder.A6(7) ; port Encoder_CLK
NetMotor_DXL_3: R40.1 U2.6(A) ; port DXL_TTL
NetR39_1: R39.1 U2.1(RO) ; port DXL_RX
NetR41_1: R41.1 R42.2 U2.7(B)
NetST-link_2: ST-link.2 ; port SWDIO
NetST-link_3: ST-link.3 ; port SWCLK
NetU1_20: U2.2(~{RE}) U2.3(DE) ; port TXD_EN
NetU1_21: U2.4(DI) ; port DXL_TX

Not connected (* = marked no-connect by the designer): DXL_Encoder A1(2)* A3(4)* A5(6)*

### Notes on the sheet
- (near ST-link) For programming Microcontroller with SWD
- We use an external test board on Dynamixel to use AS5045 Encoder
- Motor encoder converts the angular position or motion of a shaft to digital output signal and send it to microcontroller.
- (in symbol MAX485CSA) R; D

### Library data of the parts
C29 = cap805
R39-R42 = Res805
U2 = MAX485CSA: Low-Power, Slew-Rate-Limited RS-485/RS-422 Transceiver; Published: 16-Jan-2001; LatestRevisionDate: 13-Apr-2006; LatestRevisionNote: IPC-7351 Footprint Added.; DatasheetVersion: Feb-1996; PackageReference: NSO8; Publisher: Altium Limited; PackageDescription: 8-Pin Small Outline Integrated Circuit 1.27 mm Pitch; Code_JEDEC: MS-012-AA; Code_IPC: SOIC127P600-8; ComponentLink1Description: Manufacturer Link; ComponentLink1URL: http://www.maxim-ic.com/; ComponentLink2Description: Datasheet; ComponentLink2URL: http://pdfserv.maxim-ic.com/en/ds/MAX1487-MAX491.pdf

## Nets that join several sheets
3V3: [2]Microcontroller (10 pins), [3]Regulator(+5V&3V3) (R38.2), [4]Signal_ports(USART&ST-link&Encoder) (DXL_Encoder.A7)
+5V: [1]H-bridge1&Current_sensor&NOT_gate (C30.2 C31.2 U3.8), [3]Regulator(+5V&3V3) (C22.2 R37.2 Reg3V3.3), [4]Signal_ports(USART&ST-link&Encoder) (5 pins)
+12V: [3]Regulator(+5V&3V3) (C23.2 Reg5V.1), [5]Power_ports(DXL&Battery) (5 pins)
GND: [1]H-bridge1&Current_sensor&NOT_gate (14 pins), [2]Microcontroller (16 pins), [3]Regulator(+5V&3V3) (7 pins), [5]Power_ports(DXL&Battery) (Battery.2 Motor_DXL.1 R14.1), [6]H-bridge2 (9 pins), [4]Signal_ports(USART&ST-link&Encoder) (6 pins)
H-bridge1(+12V): [1]H-bridge1&Current_sensor&NOT_gate (8 pins), [5]Power_ports(DXL&Battery) (H-b1(+12V).1)
H-bridge2(+12V): [5]Power_ports(DXL&Battery) (H-b2(+12V).1), [6]H-bridge2 (10 pins)
H-bridge2ShutDown: [2]Microcontroller (U1.46), [6]H-bridge2 (B3.3 B5.3)
IP+: [1]H-bridge1&Current_sensor&NOT_gate (12 pins), [6]H-bridge2 (7 pins)
NetB3_2: [2]Microcontroller (U1.45), [6]H-bridge2 (B3.2)
NetB3_6: [1]H-bridge1&Current_sensor&NOT_gate (H-b2(-m).1), [6]H-bridge2 (7 pins)
NetB5_2: [2]Microcontroller (U1.43), [6]H-bridge2 (B5.2)
NetDXL_Encoder_A2: [2]Microcontroller (U1.25), [4]Signal_ports(USART&ST-link&Encoder) (DXL_Encoder.A2)
NetDXL_Encoder_A4: [2]Microcontroller (U1.27), [4]Signal_ports(USART&ST-link&Encoder) (DXL_Encoder.A4)
NetDXL_Encoder_A6: [2]Microcontroller (U1.26), [4]Signal_ports(USART&ST-link&Encoder) (DXL_Encoder.A6)
NetMotor_DXL_3: [5]Power_ports(DXL&Battery) (Motor_DXL.3), [4]Signal_ports(USART&ST-link&Encoder) (R40.1 U2.6)
NetR6_1: [1]H-bridge1&Current_sensor&NOT_gate (R6.1), [2]Microcontroller (U1.17)
NetR8_2: [1]H-bridge1&Current_sensor&NOT_gate (R8.2), [2]Microcontroller (U1.18)
NetR13_1: [2]Microcontroller (U1.14), [5]Power_ports(DXL&Battery) (R13.1 R14.2)
NetR15_1: [1]H-bridge1&Current_sensor&NOT_gate (R15.1 R16.2), [2]Microcontroller (U1.12)
NetR17_1: [1]H-bridge1&Current_sensor&NOT_gate (R17.1 R18.2), [2]Microcontroller (U1.11)
NetR33_1: [2]Microcontroller (U1.15), [6]H-bridge2 (R33.1 R34.2)
NetR35_1: [2]Microcontroller (U1.10), [6]H-bridge2 (R35.1 R36.2)
NetR39_1: [2]Microcontroller (U1.22), [4]Signal_ports(USART&ST-link&Encoder) (R39.1 U2.1)
NetR44_2: [1]H-bridge1&Current_sensor&NOT_gate (R44.2 U3.1), [2]Microcontroller (U1.13)
NetST-link_2: [2]Microcontroller (U1.34), [4]Signal_ports(USART&ST-link&Encoder) (ST-link.2)
NetST-link_3: [2]Microcontroller (U1.37), [4]Signal_ports(USART&ST-link&Encoder) (ST-link.3)
NetU1_20: [2]Microcontroller (U1.20), [4]Signal_ports(USART&ST-link&Encoder) (U2.2 U2.3)
NetU1_21: [2]Microcontroller (U1.21), [4]Signal_ports(USART&ST-link&Encoder) (U2.4)
NRST: [2]Microcontroller (5 pins), [4]Signal_ports(USART&ST-link&Encoder) (ST-link.5)
PWM1: [1]H-bridge1&Current_sensor&NOT_gate (R5.1), [2]Microcontroller (U1.29)
PWM2: [1]H-bridge1&Current_sensor&NOT_gate (R7.2), [2]Microcontroller (U1.30)
SWO: [2]Microcontroller (U1.39), [4]Signal_ports(USART&ST-link&Encoder) (ST-link.4)